# EAGLE design CI_V (EAGLE 7.6.0)
DATABASE: /Users/Kevin/working/CAD_Parts/IHC_Parts_DB.txt

## Sheet 1 of 4: CI-V Arduino Shield
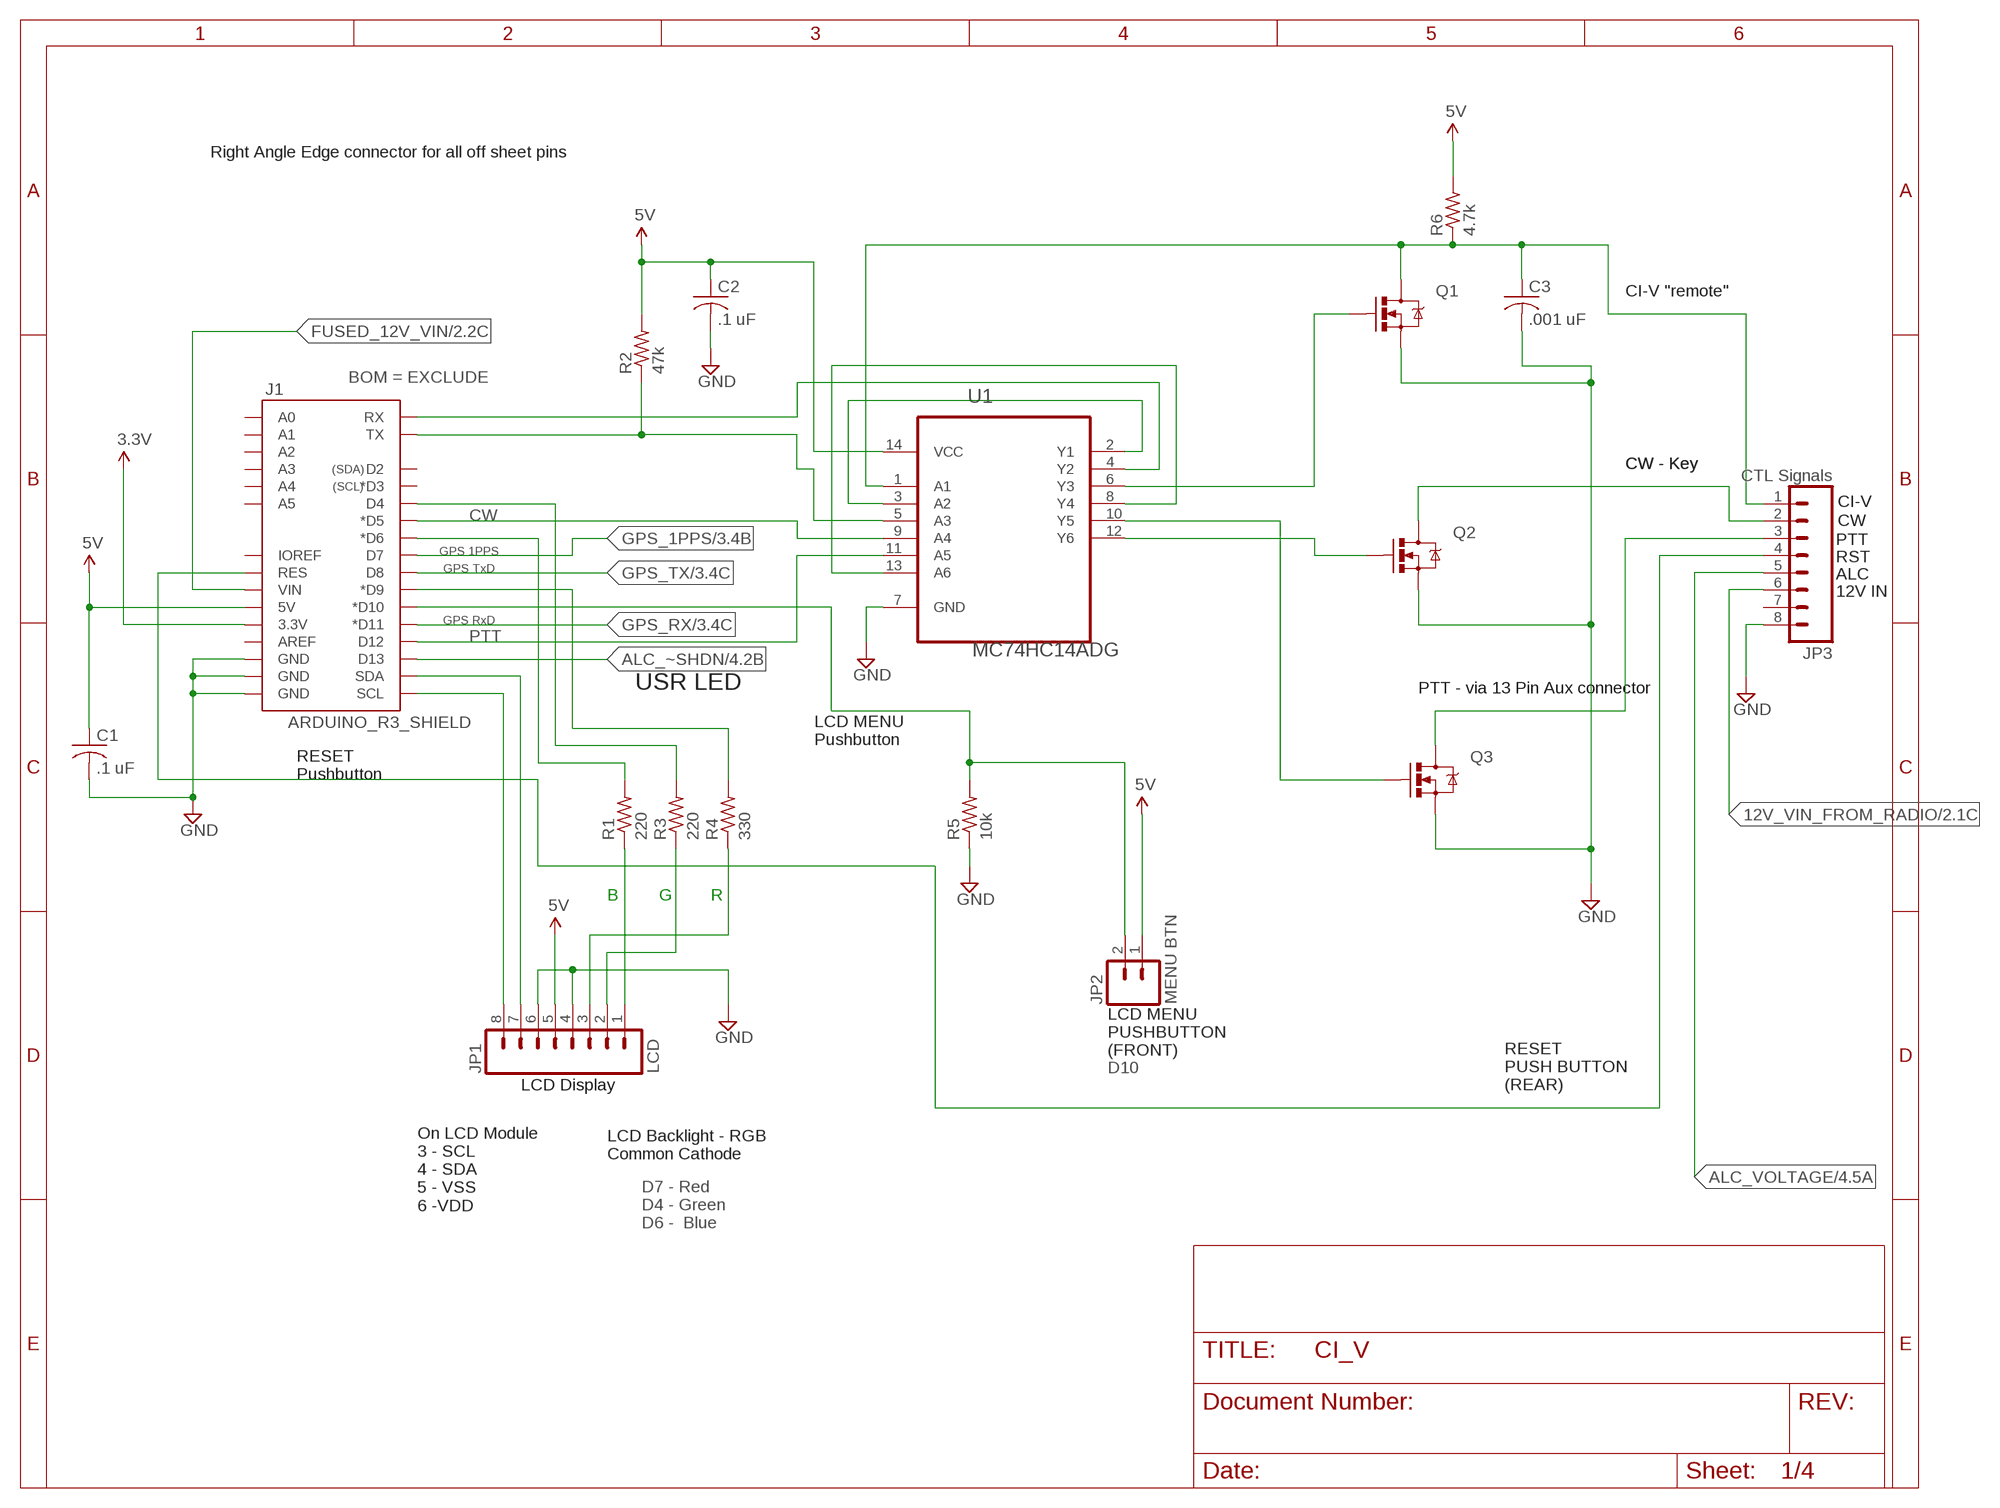
[diagram p0: schematic, sheet 1]

### Parts
C1  .1 uF  C-USC0805  [C0805]
C2  .1 uF  C-USC0805  [C0805]
C3  .001 uF  C-USC0805  [C0805]
J1  ARDUINO_R3_SHIELD  [UNO_R3_SHIELD]
JP1  LCD  M08NO_SILK  [1X08_PIN1_NO_SILK]
JP2  MENU BTN  M02PTH  [1X02]
JP3  CTL Signals  M08NO_SILK  [1X08_PIN1_NO_SILK]
Q1  MOSFET-NCHANNELBSS123LT1G  [SOT23-3]
Q2  MOSFET-NCHANNELBSS123LT1G  [SOT23-3]
Q3  MOSFET-NCHANNELBSS123LT1G  [SOT23-3]
R1  220  R-US_R0805  [R0805]
R2  47k  R-US_R0805  [R0805]
R3  220  R-US_R0805  [R0805]
R4  330  R-US_R0805  [R0805]
R5  10k  R-US_R0805  [R0805]
R6  4.7k  R-US_R0805  [R0805]
U1  MC74HC14ADG  [SOIC127P600X175-14N]

### Nets
3.3V: J1.3.3V ; also sheet 3
5V: C1.1 C2.1 J1.5V JP1.5 JP2.1 R2.2 R6.2 U1.14(VCC) ; also sheet 4
12V_VIN_FROM_RADIO: JP3.6 ; also sheet 2
ALC_VOLTAGE: JP3.5 ; also sheet 4
ALC_~SHDN: J1.D13 ; also sheet 4
CW: J1.D5(*D5) U1.9(A4)
FUSED_12V_VIN: J1.VIN ; also sheet 2
GND: C1.2 C2.2 C3.2 J1.GND@0(GND) J1.GND@1(GND) J1.GND@2(GND) JP1.4 JP1.6 JP3.8 Q1.2(S) Q2.2(S) Q3.2(S) R5.1 U1.7(GND) ; also sheet 2,3,4
GPS_1PPS: J1.D7 ; also sheet 3
GPS_RX: J1.D11(*D11) ; also sheet 3
GPS_TX: J1.D8 ; also sheet 3
HARD_RX: J1.RX U1.4(Y2)
HARD_TX: J1.TX R2.1 U1.5(A3)
N$1: C3.1 JP3.1 Q1.3(D) R6.1 U1.1(A1)
N$2: JP3.2 Q2.3(D)
N$3: JP3.3 Q3.3(D)
N$4: Q1.1(G) U1.6(Y3)
N$5: JP1.1 R1.1
N$7: JP1.2 R3.1
N$8: U1.2(Y1) U1.3(A2)
N$9: Q2.1(G) U1.12(Y6)
N$10: Q3.1(G) U1.10(Y5)
N$12: J1.SCL JP1.8
N$13: U1.8(Y4) U1.13(A6)
N$14: J1.SDA JP1.7
N$15: JP1.3 R4.1
N$16: J1.D6(*D6) R1.2
N$17: J1.D4 R3.2
N$18: J1.D9(*D9) R4.2
N$19: J1.D10(*D10) JP2.2 R5.2
N$20: J1.RES JP3.4
PTT: J1.D12 U1.11(A5)
Unconnected: J1.A0 J1.A1 J1.A2 J1.A3 J1.A4 J1.A5 J1.AREF J1.D2 J1.D3(*D3) J1.IOREF JP3.7

### Notes on the sheet
- Right Angle Edge connector for all off sheet pins
- CI-V "remote"
- CW - Key | CW - Key
- CI-V
- CW
- PTT
- GPS 1PPS
- RST
- GPS TxD
- ALC
- 12V IN
- GPS RxD
- USR LED | PTT - via 13 Pin Aux connector
- LCD MENU
  Pushbutton
- RESET
  Pushbutton
- B | G | R
- LCD MENU
  PUSHBUTTON
  (FRONT)
- D10
- LCD Display
- RESET
  PUSH BUTTON
  (REAR)
- LCD Backlight - RGB
  Common Cathode
- On LCD Module
  3 - SCL
  4 - SDA
  5 - VSS
  6 -VDD
- D7 - Red
  D4 - Green
  D6 -  Blue

## Sheet 2 of 4: Power
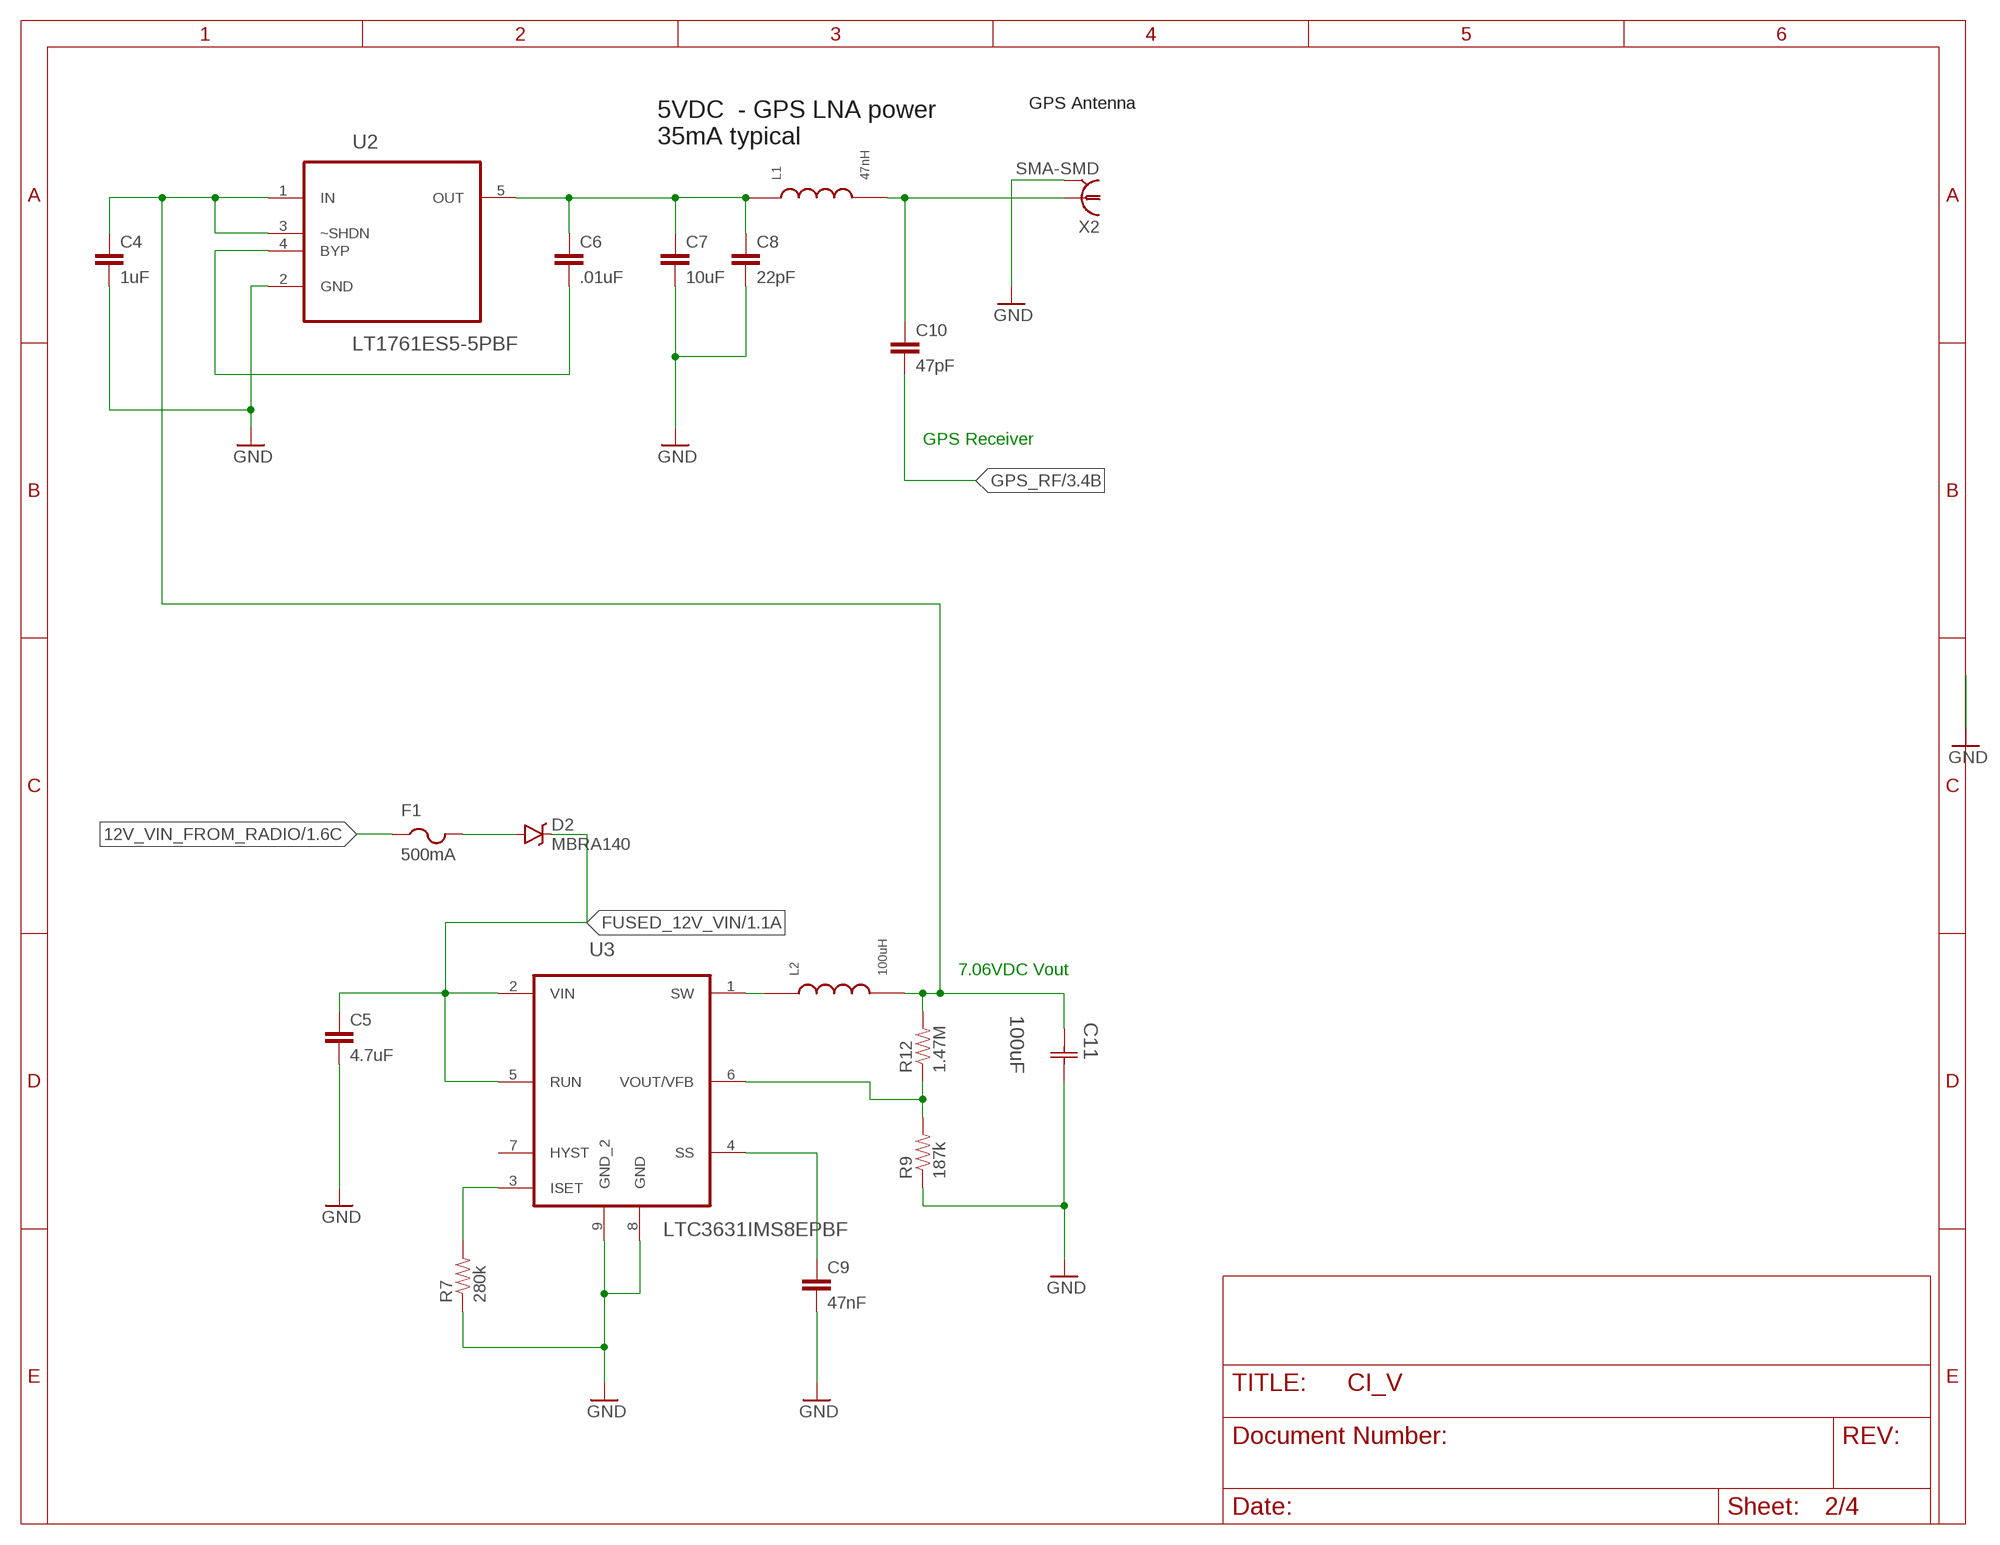
[diagram p1: schematic, sheet 2]

### Parts
C4  1uF  CAP0805  [0805]
C5  4.7uF  CAP1210  [1210]
C6  .01uF  CAP0805  [0805]
C7  10uF  CAP1210  [1210]
C8  22pF  CAP0805  [0805]
C9  47nF  CAP0805  [0805]
C10  47pF  CAP0805  [0805]
C11  100uF  THJC226K016RJN  [CAPCP6032X280N]
D2  MBRA140  DIODE-SCHOTTKY-MBRA140  [SMA-DIODE]
F1  500mA  PTCFUSE-1206  [R1206]
L1  47nH  INDUCTORMURATA  [0805]
L2  100uH  INDUCTORMURATATDK  [SLF7045]
R7  280k  RESISTOR0805-RES  [0805]
R9  187k  RESISTOR0805-RES  [0805]
R12  1.47M  RESISTOR0805-RES  [0805]
U2  LT1761ES5-5PBF  [SOT95P280X100-5N]
U3  LTC3631IMS8EPBF  [SOP65P490X110-9N]
X2  SMA-SMD  [SMA-SMD]

### Nets
7V_BUS: C4.1 C11.1(C1) L2.2 R12.2 U2.1(IN) U2.3(~SHDN)
12V_VIN_FROM_RADIO: F1.1 ; also sheet 1
FUSED_12V_VIN: C5.1 D2.C U3.2(VIN) U3.5(RUN) ; also sheet 1
GND: C4.2 C5.2 C7.2 C8.2 C9.2 C11.2(C2) R7.1 R9.1 U2.2(GND) U3.8(GND) U3.9(GND_2) X2.2@1 X2.2@2 X2.2@3 X2.2@4 X2.2@5 X2.2@6 ; also sheet 1,3,4
GPS_RF: C10.2 ; also sheet 3
ISET: R7.2 U3.3(ISET)
N$6: C10.1 L1.2 X2.1
N$21: C6.2 U2.4(BYP)
N$25: D2.A F1.2
SS: C9.1 U3.4(SS)
SW: L2.1 U3.1(SW)
VCC: C6.1 C7.1 C8.1 L1.1 U2.5(OUT)
VFB: R9.2 R12.1 U3.6(VOUT/VFB)
Unconnected: U3.7(HYST)

### Notes on the sheet
- GPS Antenna
- 5VDC  - GPS LNA power
  35mA typical
- GPS Receiver
- 7.06VDC Vout

## Sheet 3 of 4: GPS Receiver
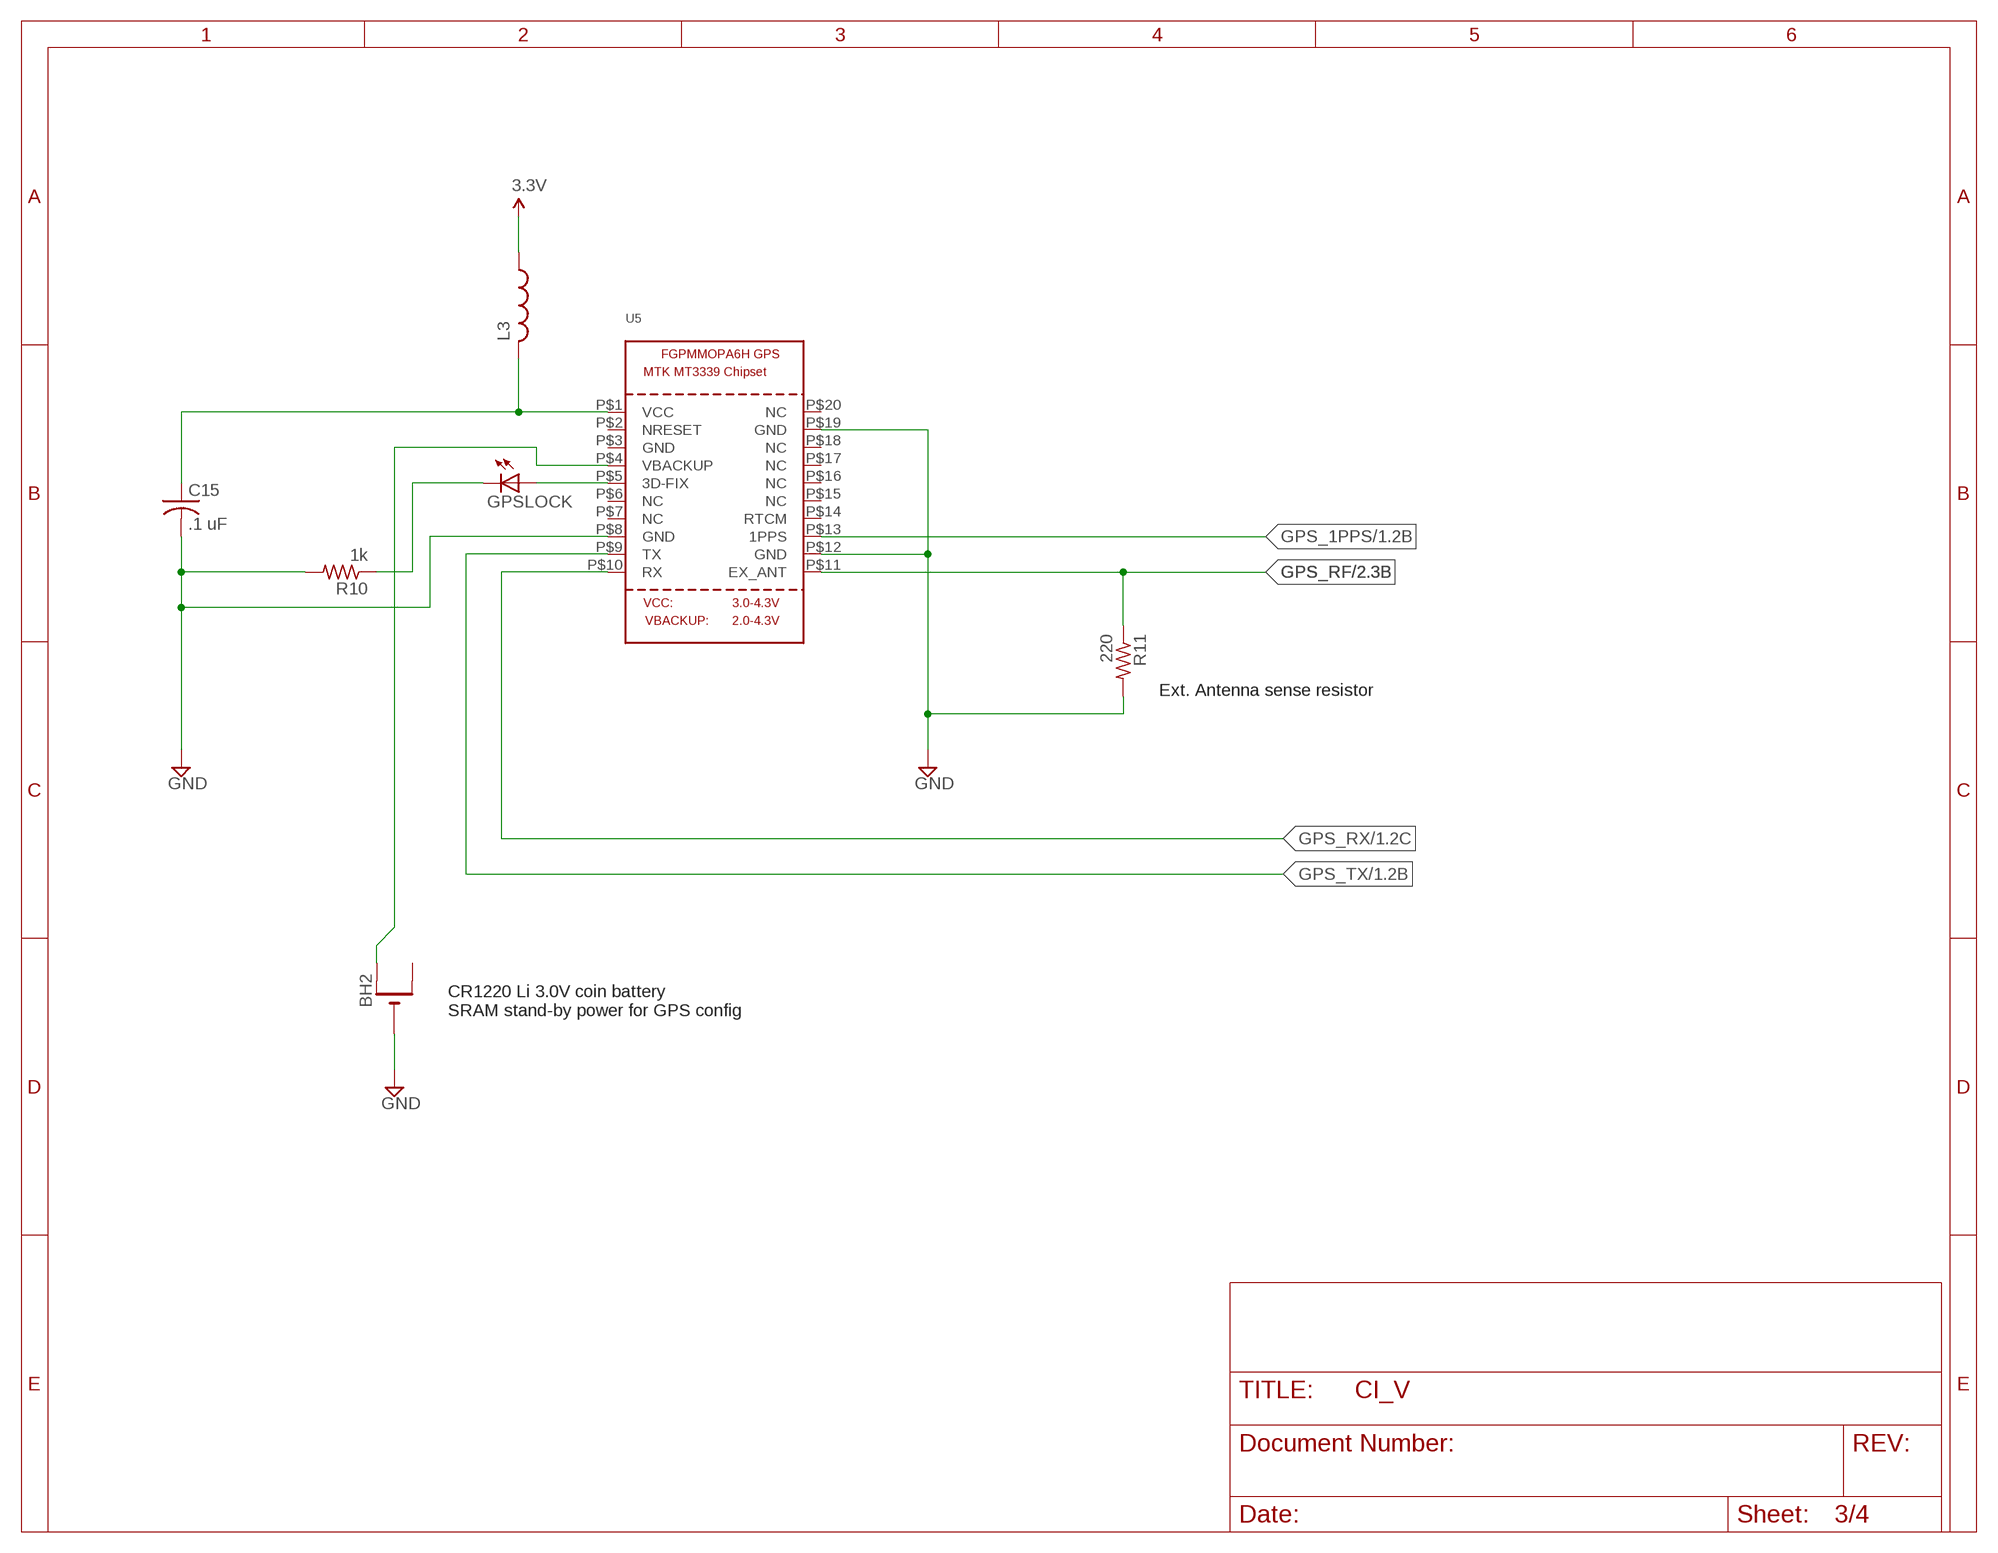
[diagram p2: schematic, sheet 3]

### Parts
BH2  CR1220SMT  [CR1220-SMD]
C15  .1 uF  C-USC0805  [C0805]
GPSLOCK  LEDCHIPLED_0805  [CHIPLED_0805]
L3  L-USL2012C  [L2012C]
R10  1k  R-US_R0805  [R0805]
R11  220  R-US_R0805  [R0805]
U5  GPS_FGPMMOPA6H  [FGPMMOPA6H]

### Nets
3.3V: L3.1 ; also sheet 1
GND: BH2.- C15.2 R10.2 R11.2 U5.P$8(GND) U5.P$12(GND) U5.P$19(GND) ; also sheet 1,2,4
GPS_1PPS: U5.P$13(1PPS) ; also sheet 1
GPS_BATT: BH2.+$1(+) U5.P$4(VBACKUP)
GPS_RF: R11.1 U5.P$11(EX_ANT) ; also sheet 2
GPS_RX: U5.P$10(RX) ; also sheet 1
GPS_TX: U5.P$9(TX) ; also sheet 1
N$11: C15.1 L3.2 U5.P$1(VCC)
N$22: GPSLOCK.A U5.P$5(3D-FIX)
N$23: GPSLOCK.C R10.1
Unconnected: BH2.+$2(+1) U5.P$2(NRESET) U5.P$3(GND) U5.P$6(NC) U5.P$7(NC) U5.P$14(RTCM) U5.P$15(NC) U5.P$16(NC) U5.P$17(NC) U5.P$18(NC) U5.P$20(NC)

### Notes on the sheet
- Ext. Antenna sense resistor
- CR1220 Li 3.0V coin battery
  SRAM stand-by power for GPS config

## Sheet 4 of 4: ALC control
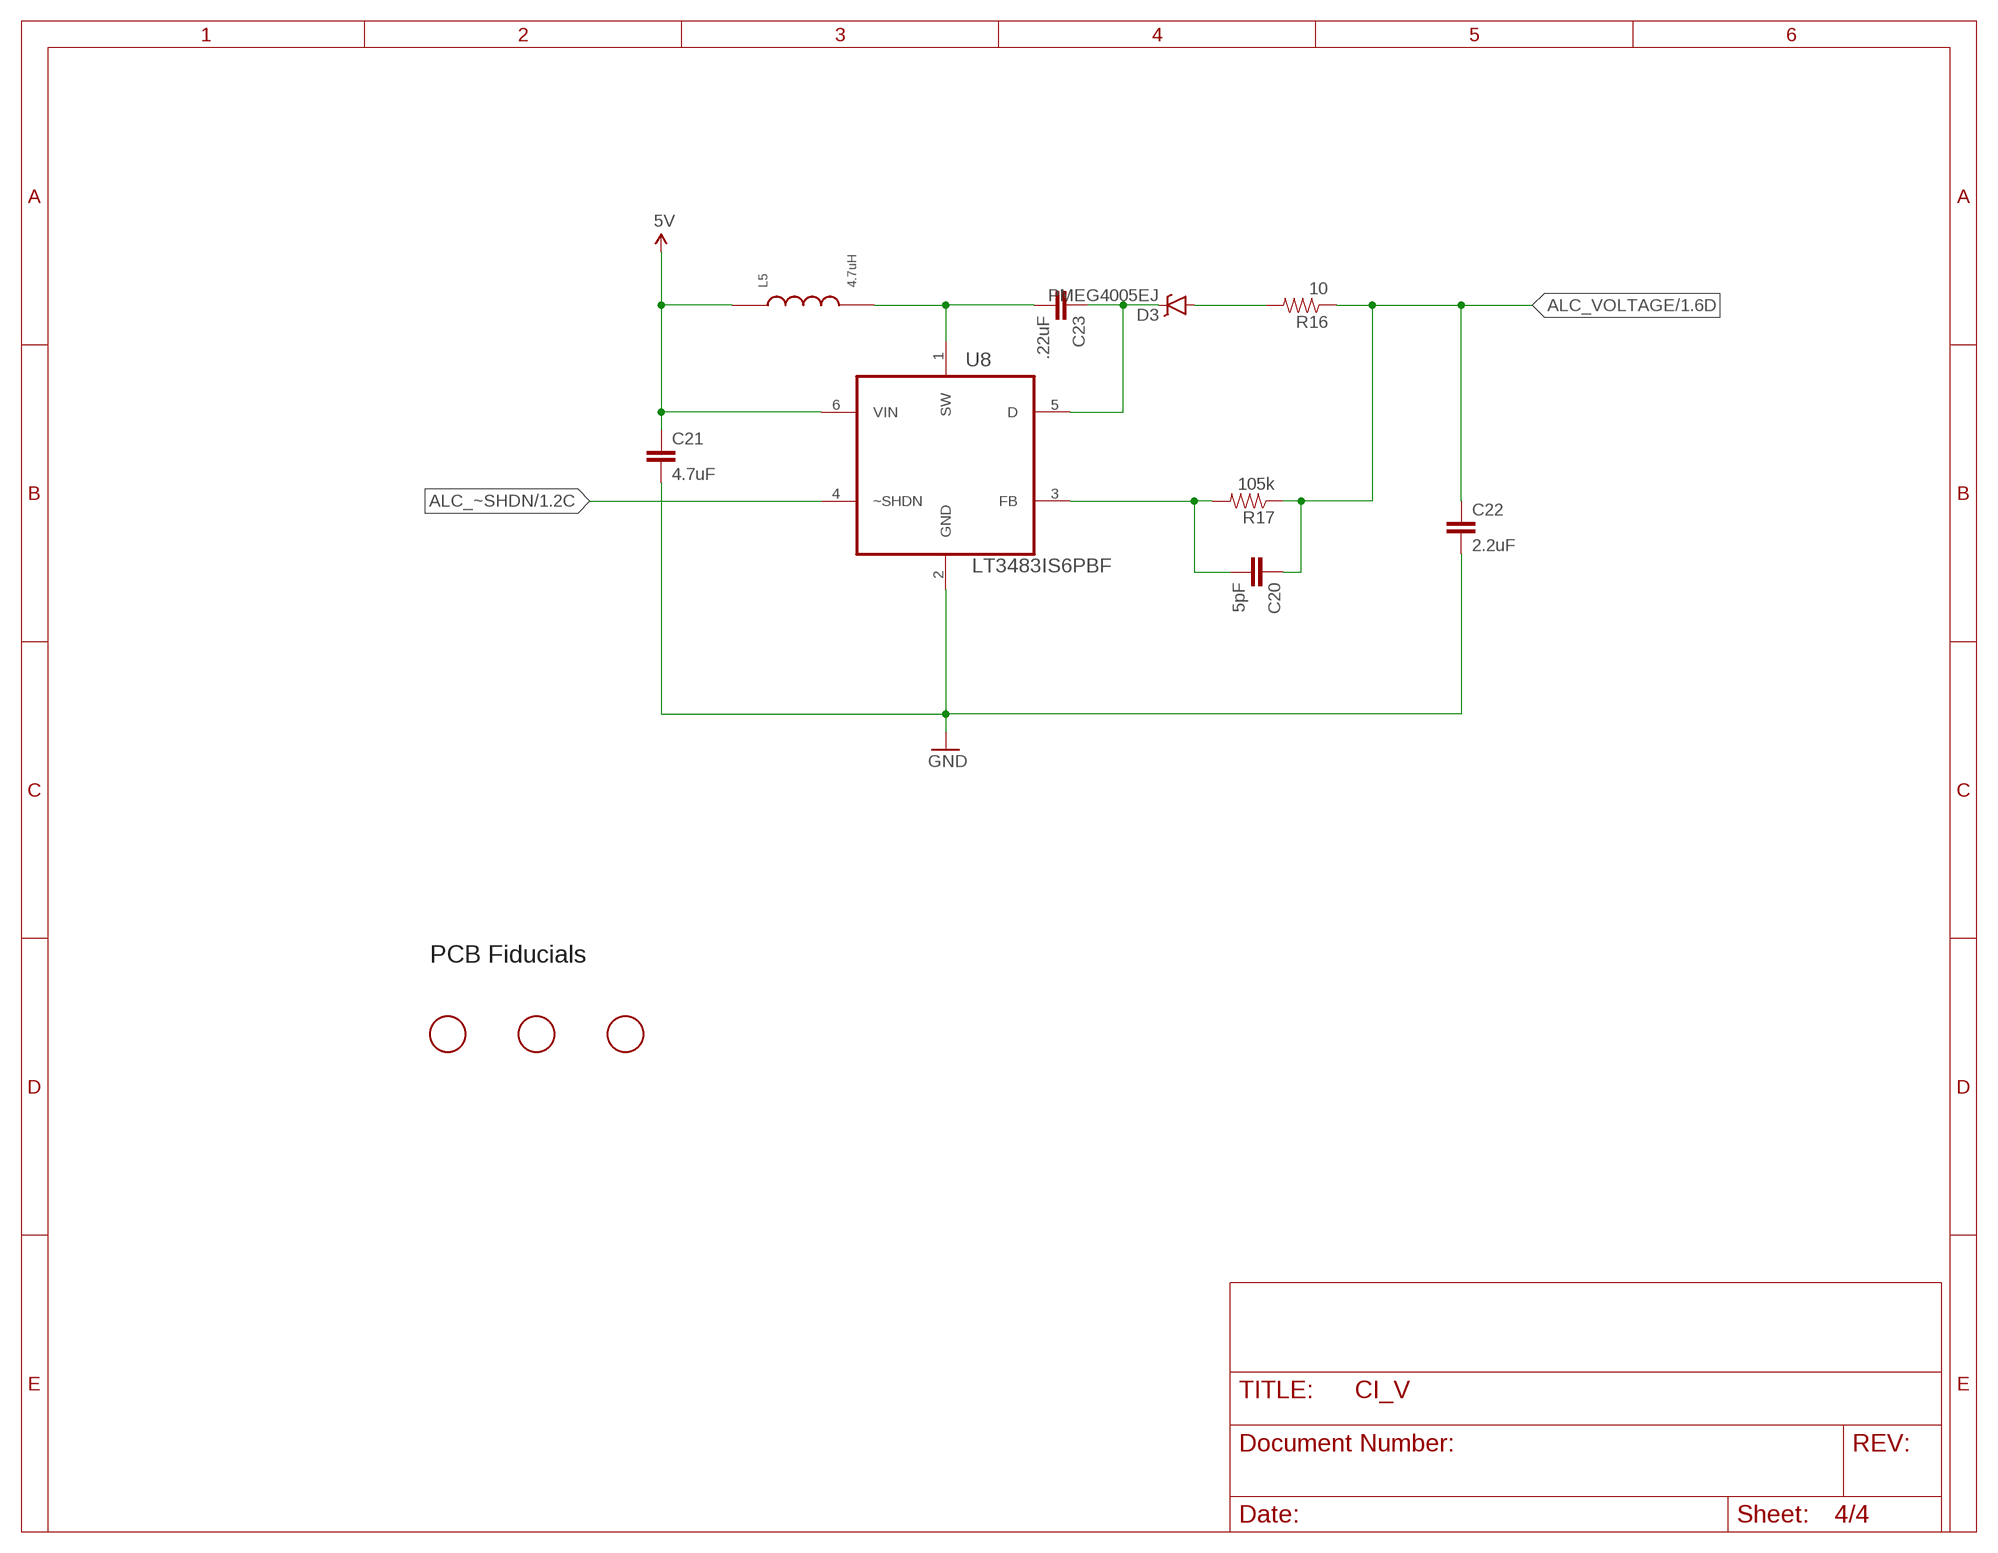
[diagram p3: schematic, sheet 4]

### Parts
C20  5pF  CAP0805  [0805]
C21  4.7uF  CAP1210  [1210]
C22  2.2uF  CAP0805  [0805]
C23  .22uF  CAP0805  [0805]
D3  PMEG4005EJ  DIODE-SCHOTTKY-PMEG4005EJ  [SOD-323]
L5  4.7uH  INDUCTORMURATA  [0805]
R16  10  RESISTOR0805-RES  [0805]
R17  105k  RESISTOR0805-RES  [0805]
U8  LT3483IS6PBF  [SOT95P280X100-6N]
U$1  FIDUCIAL  [FIDUCIAL_1MM]
U$6  FIDUCIAL  [FIDUCIAL_1MM]
U$7  FIDUCIAL  [FIDUCIAL_1MM]

### Nets
5V: C21.1 L5.1 U8.6(VIN) ; also sheet 1
ALC_VOLTAGE: C20.1 C22.1 R16.1 R17.1 ; also sheet 1
ALC_~SHDN: U8.4(~SHDN) ; also sheet 1
GND: C21.2 C22.2 U8.2(GND) ; also sheet 1,2,3
N$27: D3.A R16.2
N$28: C23.2 L5.2 U8.1(SW)
N$33: C23.1 D3.C U8.5(D)
N$37: C20.2 R17.2 U8.3(FB)

### Notes on the sheet
- PCB Fiducials

## Library data of the parts
BH2 = IHC:CR1220: CR1216/CR1220/CR1225 12mm 3V lithium coin cell Great for battery packup. Both SMT and THM holders. Note the THM package has the ground pads on both sides of the PCB so that the masks are the same - this reduces the cost; PARTNO: 165-0001-001
C1 C2 C15 = rcl:C-US: CAPACITOR, American symbol; PARTNO: 120-0001-010
C3 = rcl:C-US: CAPACITOR, American symbol; PARTNO: 120-0001-015
C4 = SparkFun-Capacitors:CAP: Capacitor Standard 0603 ceramic capacitor, and 0.1" leaded capacitor.; PARTNO: 120-0001-015
C5 C21 = SparkFun-Capacitors:CAP: Capacitor Standard 0603 ceramic capacitor, and 0.1" leaded capacitor.; PARTNO: 120-0003-011
C6 = SparkFun-Capacitors:CAP: Capacitor Standard 0603 ceramic capacitor, and 0.1" leaded capacitor.; PARTNO: 120-0001-020
C7 = SparkFun-Capacitors:CAP: Capacitor Standard 0603 ceramic capacitor, and 0.1" leaded capacitor.; PARTNO: 120-0003-010
C8 = SparkFun-Capacitors:CAP: Capacitor Standard 0603 ceramic capacitor, and 0.1" leaded capacitor.; PARTNO: 120-0004-011
C9 = SparkFun-Capacitors:CAP: Capacitor Standard 0603 ceramic capacitor, and 0.1" leaded capacitor.; PARTNO: 120-0001-013
C10 C20 = SparkFun-Capacitors:CAP: Capacitor Standard 0603 ceramic capacitor, and 0.1" leaded capacitor.; PARTNO: 120-0004-010
C11 = AVX_By_element14_Batch_1:THJC226K016RJN: Tantalum Capacitor , 2312; CAPACITANCETOLERANCE: ±10%; MPN: THJC226K016RJN; OC_FARNELL: 1707045; OC_NEWARK: 57P7383; PARTNO: 120-0005-050; SUPPLIER: AVX; VALUE: 22µF; VOLTAGERATING: 16V
C22 = SparkFun-Capacitors:CAP: Capacitor Standard 0603 ceramic capacitor, and 0.1" leaded capacitor.; PARTNO: 120-0002-011
C23 = SparkFun-Capacitors:CAP: Capacitor Standard 0603 ceramic capacitor, and 0.1" leaded capacitor.; PARTNO: 120-0001-022
D2 = SparkFun-DiscreteSemi:DIODE-SCHOTTKY: Schottky diodes in SFE's production catalog BAT20J 1A 23V 0.62Vf RB751 120mA 40V 0.37Vf PMEG4005EJ 0.5A 40V 0.42Vf MBRA140 1A 40V 0.5Vf B340A 3A 40V SMA; PARTNO: 140-0001-001; PROD_ID: DIO-08053
D3 = SparkFun-DiscreteSemi:DIODE-SCHOTTKY: Schottky diodes in SFE's production catalog BAT20J 1A 23V 0.62Vf RB751 120mA 40V 0.37Vf PMEG4005EJ 0.5A 40V 0.42Vf MBRA140 1A 40V 0.5Vf B340A 3A 40V SMA; PARTNO: 140-0002-001; PROD_ID: DIO-10955
F1 = adafruit:PTCFUSE: PTC fuses, resettable thermistors; PARTNO: 145-0001-001
GPSLOCK = adafruit:LED: LED OSRAM: - CHIPLED LG R971, LG N971, LY N971, LG Q971, LY Q971, LO R971, LY R971 LH N974, LH R974 LS Q976, LO Q976, LY Q976 LO Q996 - Hyper CHIPLED LW Q18S LB Q993, LB Q99A, LB R99A - SideLED LS A670, LO A670, LY A670, LG A670, LP A670 LB A673, LV A673, LT A673, LW A673 LH A674 LY A675 LS A676, LA A676, LO A676, LY A676, LW A676 LS A679, LY A679, LG A679 - Hyper Micro SIDELED® LS Y876, LA Y876, LO Y876, LY Y876 LT Y87S - SmartLED LW L88C, LW L88S LB L89C, LB L89S, LG L890 LS L89K, LO L89K, LY L89K LS L896, LA L896, LO L896, LY L896 - TOPLED LS T670, LO T670, LY T670, LG T670, LP T670 LSG T670, LSP T670, LSY T670, LOP T670, LYG T670 LG T671, LOG T671, LSG T671 LB T673, LV T673, LT T673, LW T673 LH T674 LS T676, LA T676, LO T676, LY T676, LB T676, LH T676, LSB T676, LW T676 LB T67C, LV T67C, LT T67C, LS T67K, LO T67K, LY T67K, LW E67C LS E67B, LA E67B, LO E67B, LY E67B, LB E67C, LV E67C, LT E67C LW T67C LS T679, LY T679, LG T679 LS T770, LO T770, LY T770, LG T770, LP T770 LB T773, LV T773, LT T773, LW T773 LH T774 LS E675, LA E675, LY E675, LS T675 LS T776, LA T776, LO T776, LY T776, LB T776 LHGB T686 LT T68C, LB T68C - Hyper Mini TOPLED® LB M676 - Mini TOPLED Santana® LG M470 LS M47K, LO M47K, LY M47K Source: http://www.osram.convergy.de/; PARTNO: 160-0007-001
J1 = IHC:ARDUINO_R3_SHIELD: Shield form compatible with the Arduino Uno R3.; BOM: EXCLUDE
JP1 JP3 = SparkFun-Connectors:M08: Header 8 Standard 8-pin 0.1" header. Use with straight break away headers (SKU : PRT-00116), right angle break away headers (PRT-00553), swiss pins (PRT-00743), machine pins (PRT-00117), and female headers (PRT-00115).; PARTNO: 125-0019-001
JP2 = IHC:M02: Standard 2-pin 0.1" header. Use with - straight break away headers ( PRT-00116) - right angle break away headers (PRT-00553) - swiss pins (PRT-00743) - machine pins (PRT-00117) - female headers (PRT-00115) Molex polarized connector foot print use with: PRT-08233 with associated crimp pins and housings. 2.54_SCREWTERM for use with PRT-10571. 3.5mm Screw Terminal footprints for PRT-08084 5mm Screw Terminal footprints for use with PRT-08432; PARTNO: 125-0019-001
L1 = IHC:INDUCTOR; PARTNO: 155-0002-001
L2 = IHC:INDUCTOR; PARTNO: 155-0001-001
L3 = rcl:L-US: INDUCTOR, American symbol; PARTNO: 155-0004-001
L5 = IHC:INDUCTOR; PARTNO: 155-0003-001
Q1-Q3 = SparkFun-DiscreteSemi:MOSFET-NCHANNEL: Common NMOSFET Parts MFG P/N Store ID Prod ID FDD8780 TRANS-09984 SI7820DN TRANS-11055 FDS6630A IC-08089 2N7002PW TRANS-11151 FQP30N06L COM-10213 TRANS-10060 BSS123LT1G TRANS-08345 BSS138 TRANS-00830 BS170 2N7000; PARTNO: 185-0001-001; PROD_ID: TRANS-08345
R1 R3 R11 = rcl:R-US_: RESISTOR, American symbol; PARTNO: 110-0001-010
R2 R6 = rcl:R-US_: RESISTOR, American symbol; PARTNO: 110-0001-030
R4 R5 = rcl:R-US_: RESISTOR, American symbol; PARTNO: 110-0001-025
R7 = SparkFun-Passives:RESISTOR: Resistor Basic schematic elements and footprints for 0603, 1206, and PTH resistors.; PARTNO: 110-0002-015
R9 = SparkFun-Passives:RESISTOR: Resistor Basic schematic elements and footprints for 0603, 1206, and PTH resistors.; PARTNO: 110-0002-020
R10 = rcl:R-US_: RESISTOR, American symbol; PARTNO: 110-0001-029
R12 = SparkFun-Passives:RESISTOR: Resistor Basic schematic elements and footprints for 0603, 1206, and PTH resistors.; PARTNO: 110-0002-010
R16 = SparkFun-Passives:RESISTOR: Resistor Basic schematic elements and footprints for 0603, 1206, and PTH resistors.; PARTNO: 110-0001-027
R17 = SparkFun-Passives:RESISTOR: Resistor Basic schematic elements and footprints for 0603, 1206, and PTH resistors.; PARTNO: 110-0003-010
U1 = ON Semiconductor_By_element14_Batch_1:MC74HC14ADG: Hex Schmitt-Trigger Inverter; MPN: MC74HC14ADG; OC_FARNELL: 9666931; OC_NEWARK: 71J5595; PACKAGE: SOIC-14; PARTNO: 200-0001-001; SUPPLIER: ON SEMICONDUCTOR
U2 = LTC_By_element14_Batch_1:LT1761ES5-5PBF: 100mA, Low Noise,LDO Micropower Regulators; MPN: LT1761ES5-5#PBF; OC_FARNELL: 1533302; OC_NEWARK: 61M3359; PACKAGE: TSOT-23-5; PARTNO: 230-0002-001; SUPPLIER: Linear Technology
U3 = IHC:LTC3631IMS8EPBF: Step-Down Converter; MPN: LTC3631IMS8E#PBF; OC_FARNELL: -; OC_NEWARK: 24R8687; PACKAGE: MSOP-8; PARTNO: 230-0003-001; SUPPLIER: Linear Technology
U5 = adafruit:GPS_FGPMMOPA6H: GPS Module - MTK MT3339 Chipset, -165dBm sensitivity, 22 channels, 10Hz, auto-select external antenna options; PARTNO: 240-0001-001
U8 = IHC:LT3483IS6PBF: Inverting Micropower DC/DC Converters with Schottky; MPN: LT3483IS6#PBF; OC_FARNELL: -; OC_NEWARK: 84R9683; PACKAGE: TSOT-23-6; SUPPLIER: Linear Technology
U$1 U$6 U$7 = adafruit:FIDUCIAL: For use by pick and place machines to calibrate the vision/machine, 1mm By microbuilder.eu
X2 = con-coax:SMA-SMD: SMA 50 Ohm Straight Jack Receptacle - Surface Mount www.johnsoncomponents.com Source: http://catalog.digikey.com .. 142-0711-201, 205, 202, 206.pdf; OC_FARNELL: unknown; OC_NEWARK: unknown; PARTNO: 125-0018-001

## Net classes
0 default: clearance 0.205 mm

## Board
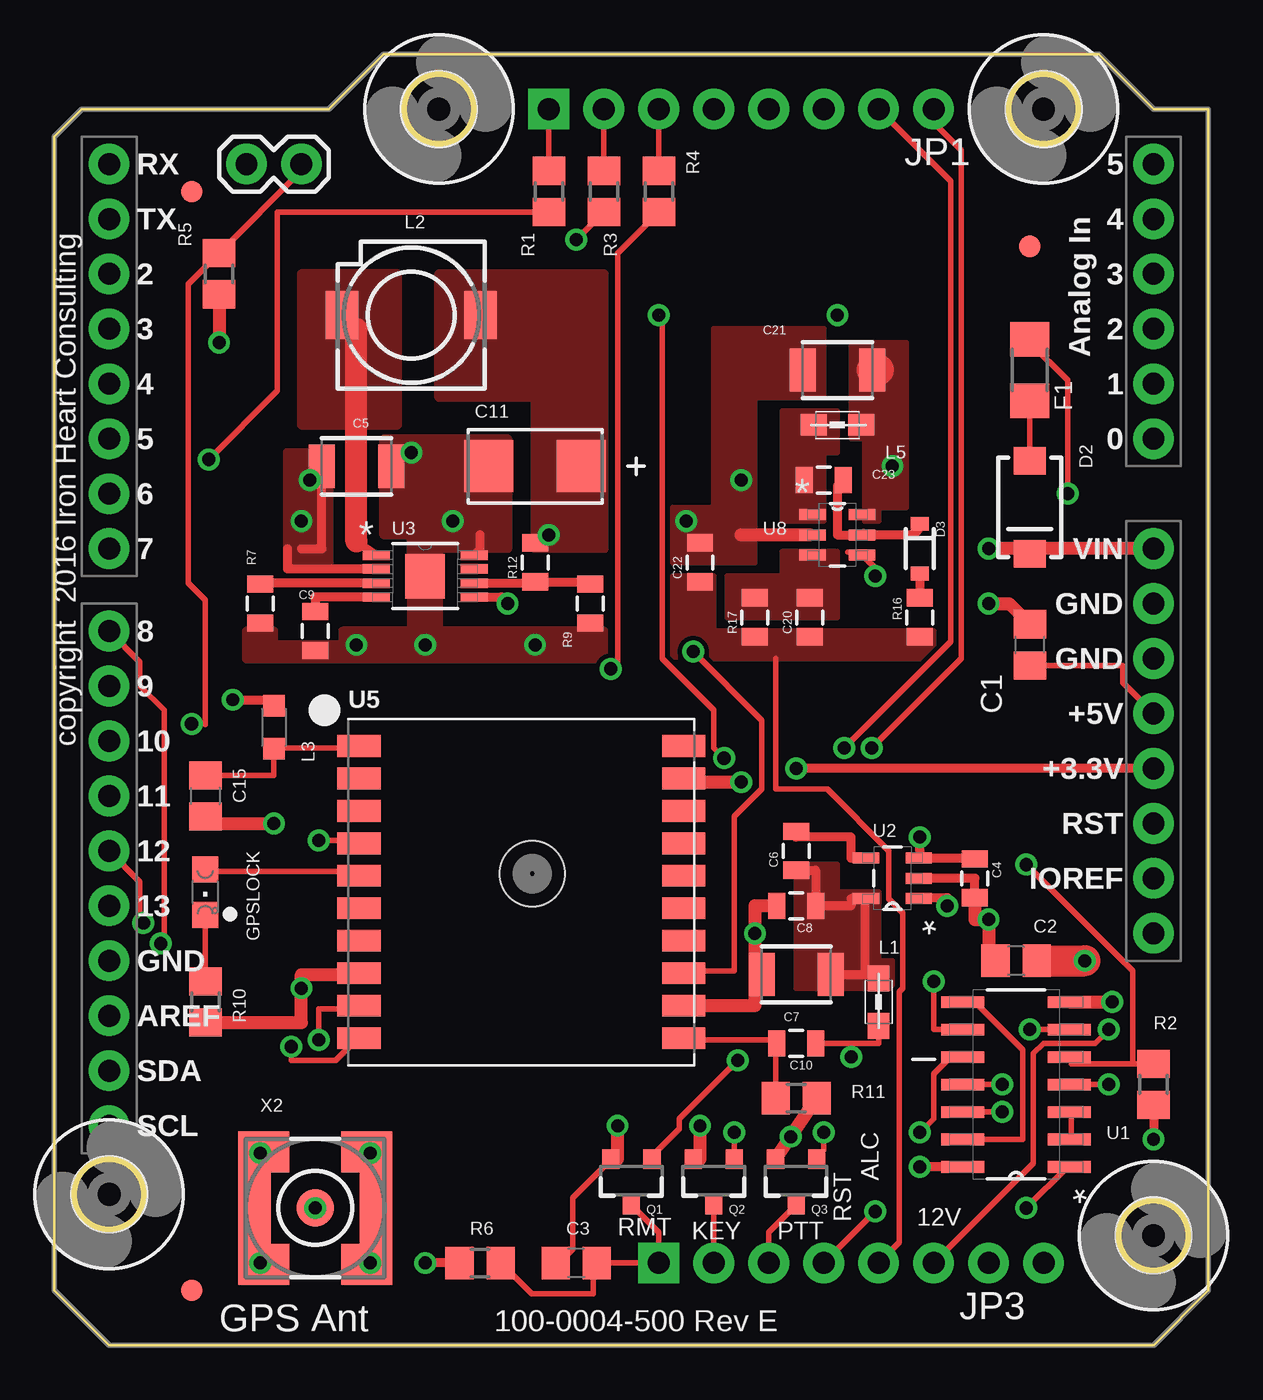
[diagram p4: board, top side]
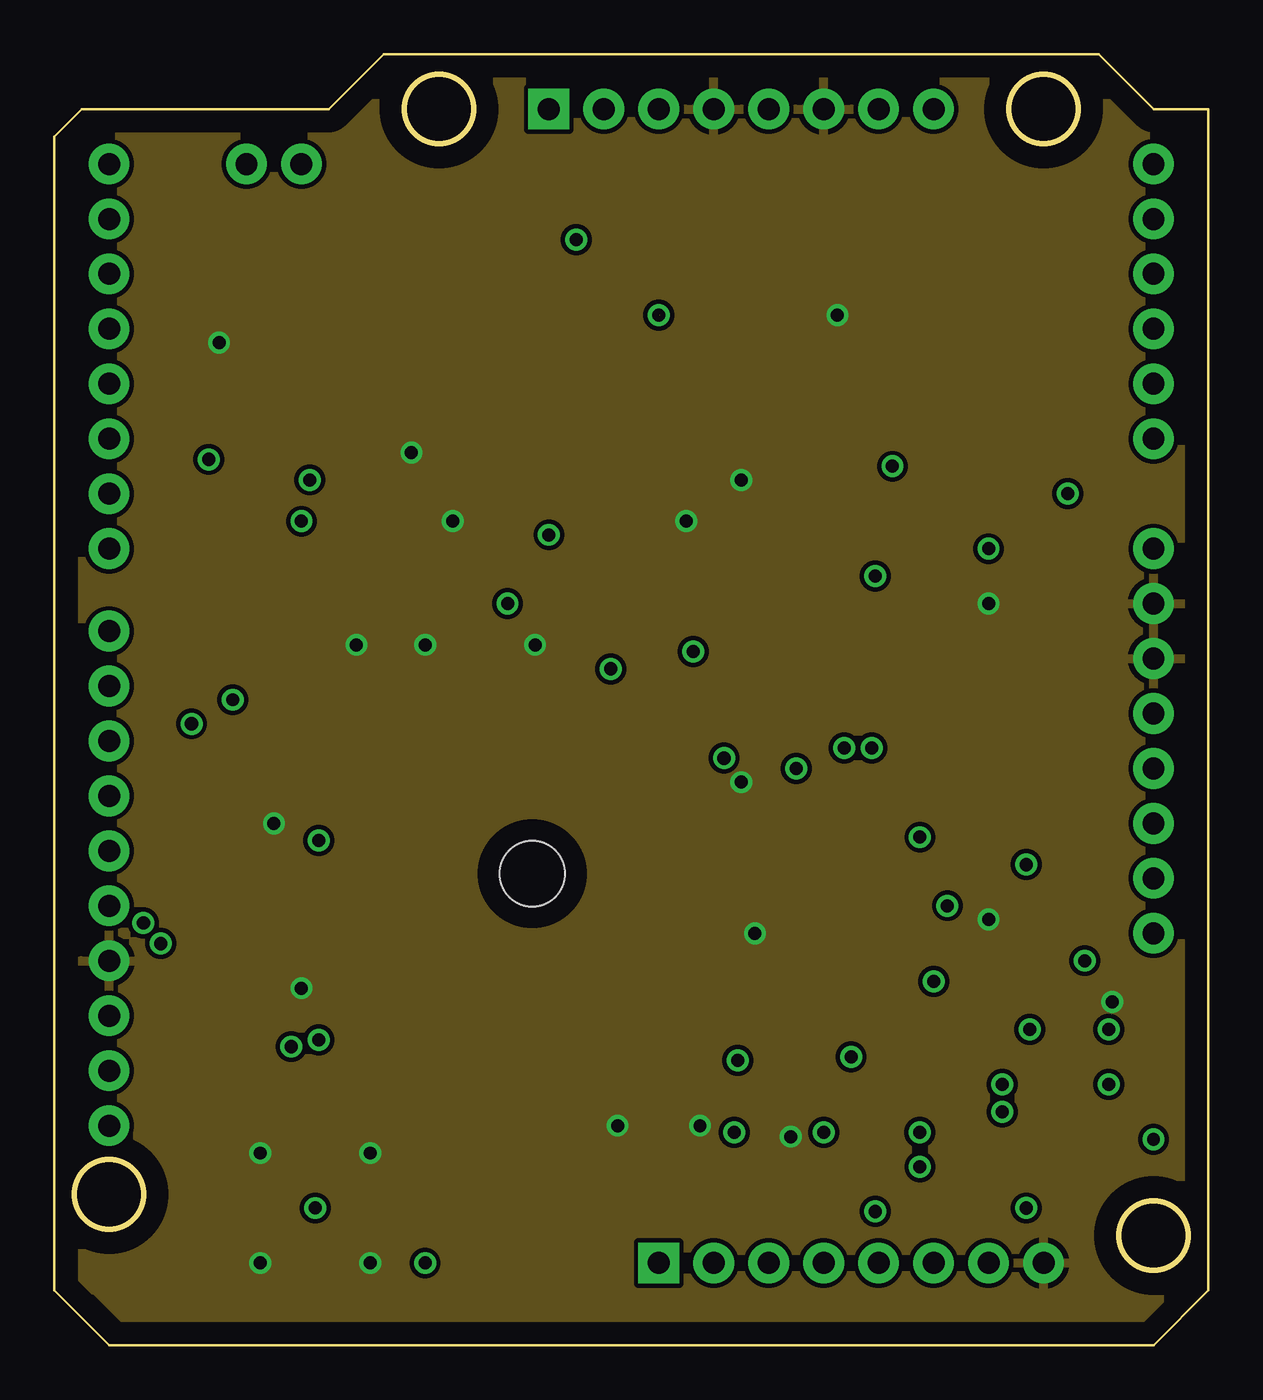
[diagram p5: board, inner layer Route2]
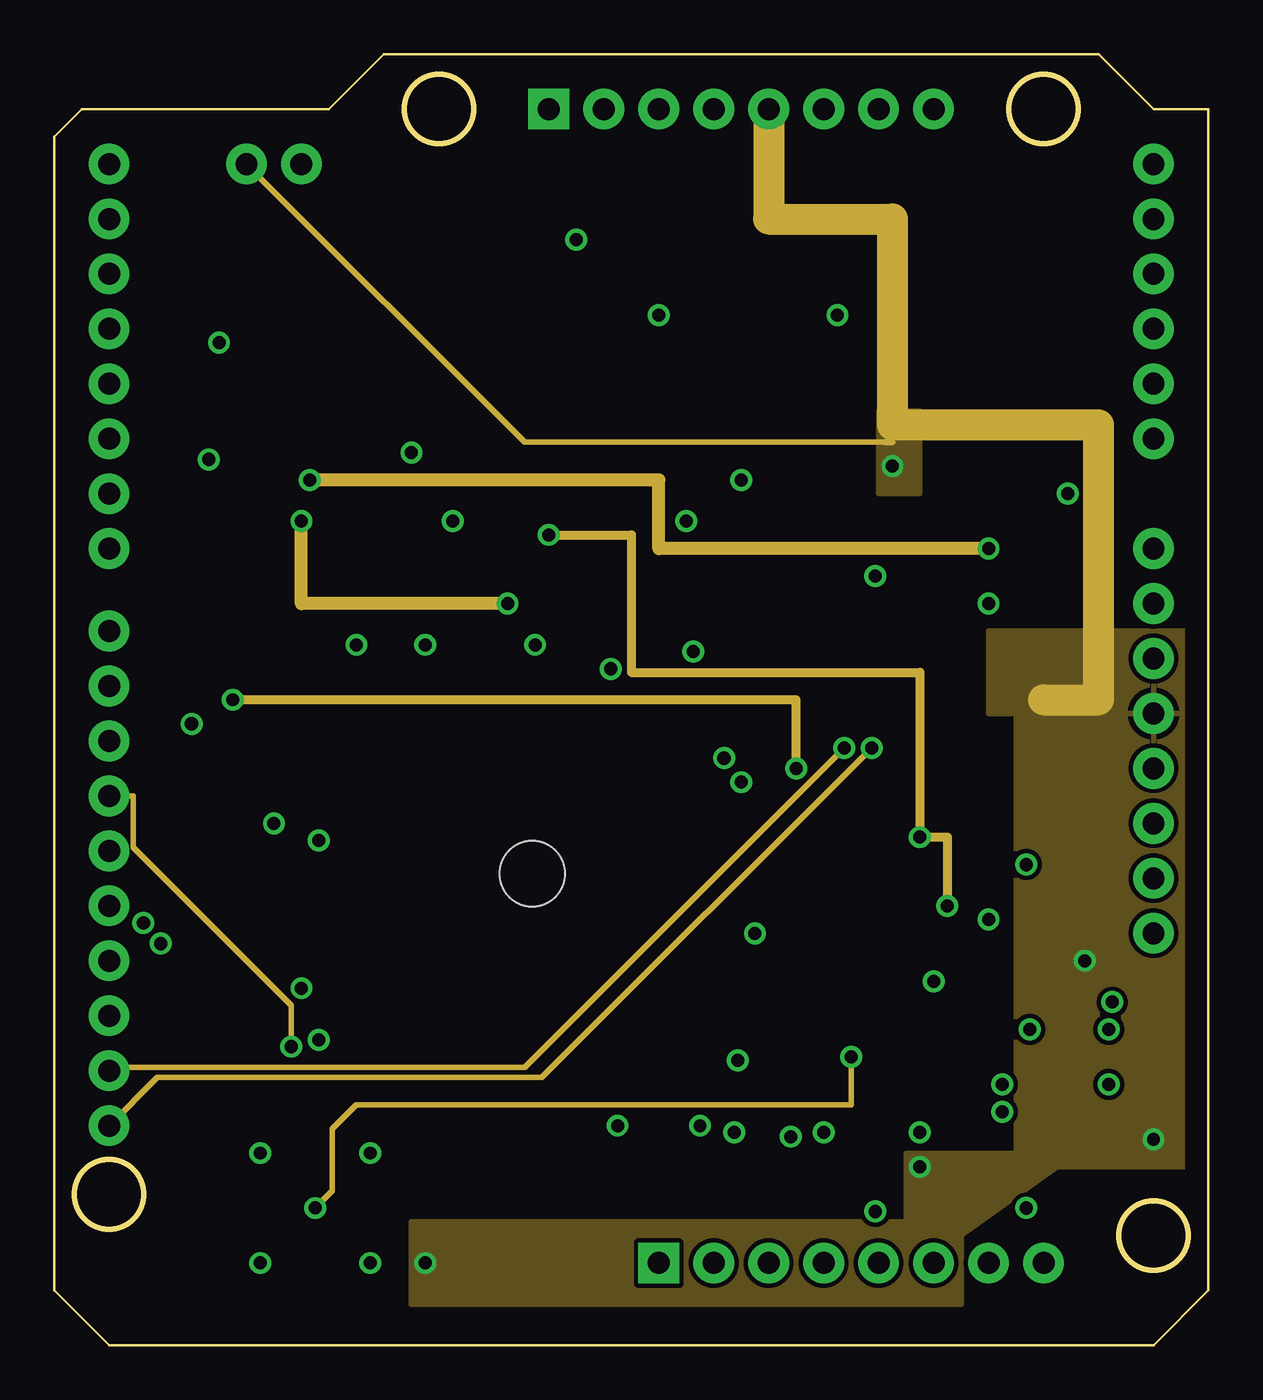
[diagram p6: board, inner layer Route15]
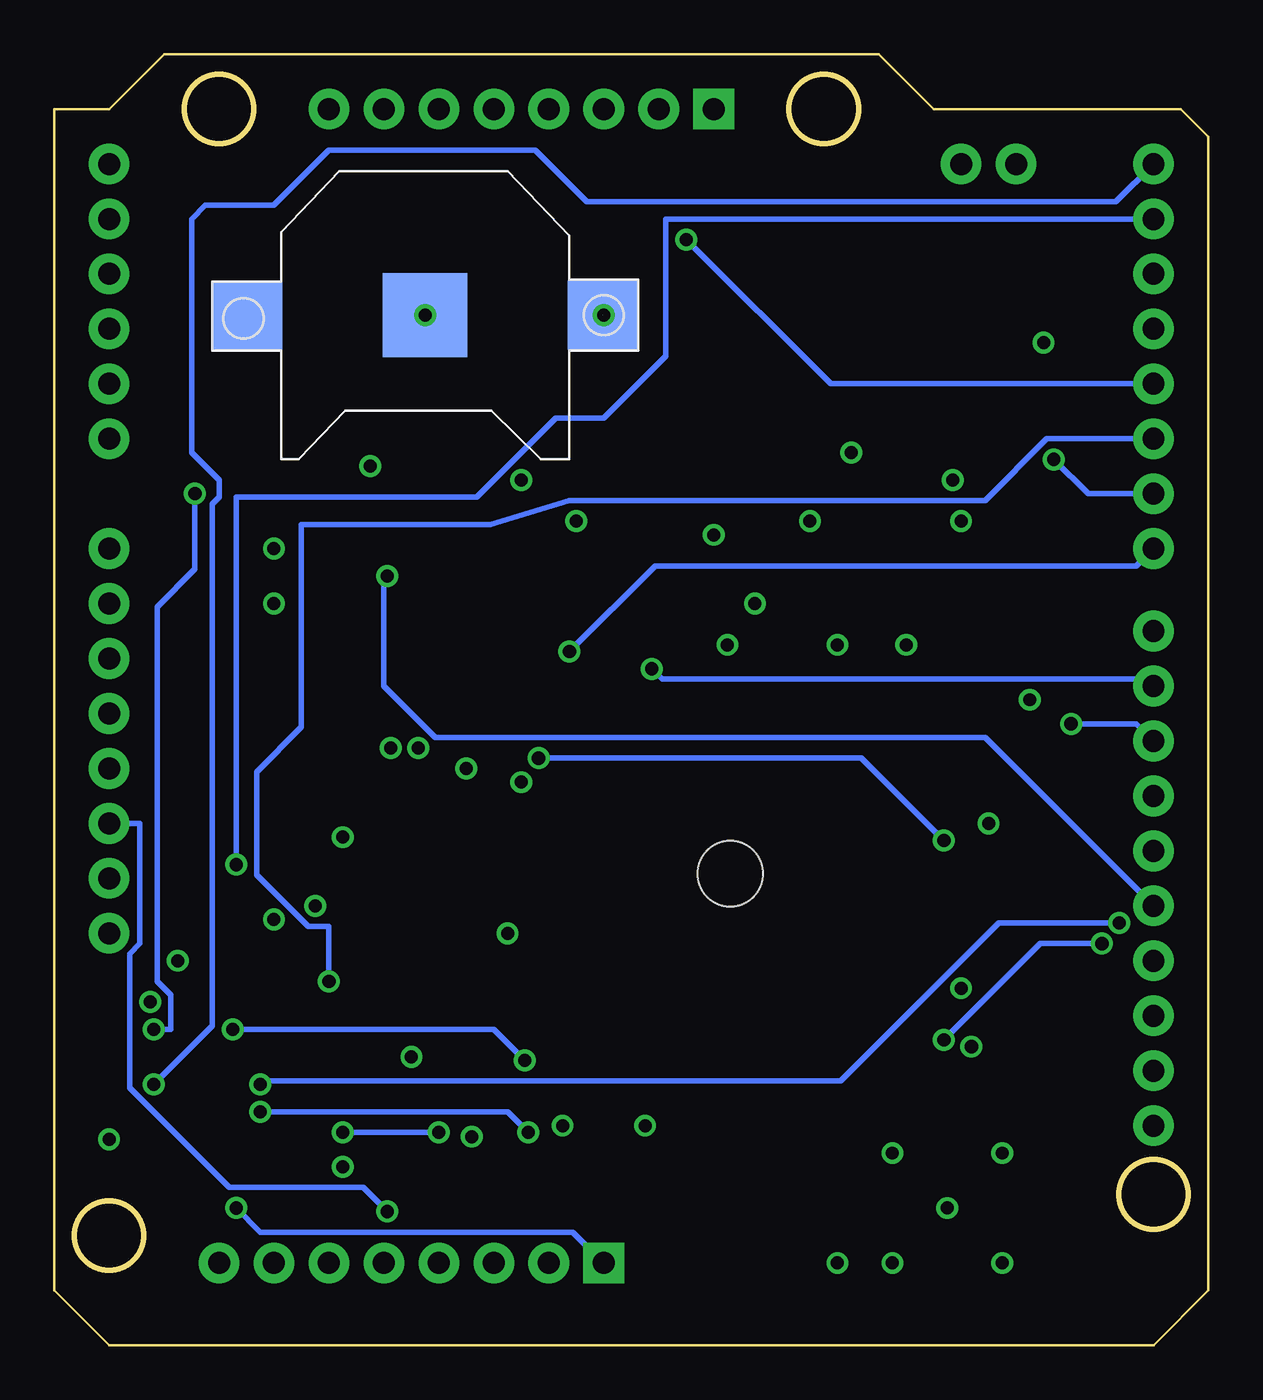
[diagram p7: board, bottom side, seen from below]

Size 51.46 x 55.27 mm. Coordinates in mm from the lower left corner, seen from the top.
Outline: circle at 44.78,53.67 radius 1.6
Outline: circle at 1.6,3.51 radius 1.6
Outline: circle at 49.86,1.6 radius 1.6
Outline: circle at 16.84,53.67 radius 1.6
Copper layers (1*2+15*16): Top 0.035mm / dielectric 0.2mm / Route2 0.035mm / dielectric 1.5mm / Route15 0.035mm / dielectric 0.2mm / Bottom 0.035mm
Design rules "default *": minimum track width 10mil, minimum drill 24mil, track to track 8mil, track to pad 8mil, pad to pad 8mil, via to via 8mil, smd to smd 8mil, copper to edge 40mil, drill to drill 8mil, minimum pad ring 10mil, minimum via ring 8mil, stop-mask expansion 4mil, vias tented up to drill 0mil, thermal gap 10mil
tRestrict: area 14.3,9.2 to 27,25.1

### Footprints (pad centres in the part's own frame; a part is rotated, then mirrored left to right if it is on the bottom)
CR1220-SMD = smd 3.2 x 3.2: +$1 -8.2,0; +$2 8.2,0 | smd 3.9 x 3.9: - 0,0
C0805 = smd 1.3 x 1.5: 1 -0.95,0; 2 0.95,0
0805 = smd 0.8 x 1.2: 1 -0.9,0; 2 0.9,0
1210 = smd 1.2 x 2: 1 -1.6,0; 2 1.6,0
CAPCP6032X280N = smd 2.261 x 2.413: 1 -2.134,0; 2 2.134,0
SMA-DIODE = smd 1.27 x 1.47: A -2.15,0; C 2.15,0
SOD-323 = smd 0.63 x 0.83: A 1.15,0; C -1.15,0
R1206 = smd 1.6 x 1.803: 1 -1.422,0; 2 1.422,0
CHIPLED_0805 = smd 1.2 x 1.2: A 0,-1.05; C 0,1.05
UNO_R3_SHIELD = drill 1.016 pad 1.88: 3.3V 50.8,26.67; 5V 50.8,29.21; A0 50.8,41.91; A1 50.8,44.45; A2 50.8,46.99; A3 50.8,49.53; A4 50.8,52.07; A5 50.8,54.61; AREF 2.54,15.24; D2 2.54,49.53; D3 2.54,46.99; D4 2.54,44.45; D5 2.54,41.91; D6 2.54,39.37; D7 2.54,36.83; D8 2.54,33.02; D9 2.54,30.48; D10 2.54,27.94; D11 2.54,25.4; D12 2.54,22.86; D13 2.54,20.32; GND@0 50.8,31.75; GND@1 50.8,34.29; GND@2 2.54,17.78; IOREF 50.8,21.59; NC 50.8,19.05; RES 50.8,24.13; RX 2.54,54.61; SCL 2.54,10.16; SDA 2.54,12.7; TX 2.54,52.07; VIN 50.8,36.83
1X08_PIN1_NO_SILK = drill 1.016 pad 1.88 square: 1 0,0 | drill 1.016 pad 1.88: 2 2.54,0; 3 5.08,0; 4 7.62,0; 5 10.16,0; 6 12.7,0; 7 15.24,0; 8 17.78,0
1X02 = drill 1.016 pad 1.88: 1 0,0; 2 2.54,0
0805' = smd 1.2 x 1: 1 -1.1,0; 2 1.1,0
SLF7045 = smd 1.5 x 2.2: 1 -3.2,0; 2 3.2,0
L2012C = smd 1 x 1: 1 -1,0; 2 1,0
SOT23-3 = smd 0.8 x 0.9: 1 -0.95,-1; 2 0.95,-1; 3 0,1.1
R0805 = smd 1.3 x 1.5: 1 -0.95,0; 2 0.95,0
SOIC127P600X175-14N = smd 1.981 x 0.533: 1 -2.464,3.81; 2 -2.464,2.54; 3 -2.464,1.27; 4 -2.464,0; 5 -2.464,-1.27; 6 -2.464,-2.54; 7 -2.464,-3.81; 8 2.464,-3.81; 9 2.464,-2.54; 10 2.464,-1.27; 11 2.464,0; 12 2.464,1.27; 13 2.464,2.54; 14 2.464,3.81
SOT95P280X100-5N = smd 1.219 x 0.508: 1 -1.219,0.94; 2 -1.219,0; 3 -1.219,-0.94; 4 1.219,-0.94; 5 1.219,0.94
SOP65P490X110-9N = smd 1.245 x 0.432: 1 -2.261,0.965; 2 -2.261,0.33; 3 -2.261,-0.33; 4 -2.261,-0.965; 5 2.261,-0.965; 6 2.261,-0.33; 7 2.261,0.33; 8 2.261,0.965 | smd 1.829 x 2.057: 9 0,0
FGPMMOPA6H = smd 2 x 1: P$1 -7.5,6.75; P$2 -7.5,5.25; P$3 -7.5,3.75; P$4 -7.5,2.25; P$5 -7.5,0.75; P$6 -7.5,-0.75; P$7 -7.5,-2.25; P$8 -7.5,-3.75; P$9 -7.5,-5.25; P$10 -7.5,-6.75; P$11 7.5,-6.75; P$12 7.5,-5.25; P$13 7.5,-3.75; P$14 7.5,-2.25; P$15 7.5,-0.75; P$16 7.5,0.75; P$17 7.5,2.25; P$18 7.5,3.75; P$19 7.5,5.25; P$20 7.5,6.75 | hole 3: 0.5,0.85
SOT95P280X100-6N = smd 1.219 x 0.508: 1 -1.143,0.94; 2 -1.143,0; 3 -1.143,-0.94; 4 1.143,-0.94; 5 1.143,0; 6 1.143,0.94
FIDUCIAL_1MM = smd 1 x 1: 1 0,0
3,2 = hole 3.2: 0,0
SMA-SMD = smd 1.73 x 1.73: 1 0,0 | smd 2.35 x 1.9: 2@1 -2.375,2.6; 2@2 -2.375,-2.6; 2@3 2.375,-2.6; 2@4 2.375,2.6 | smd 1.5 x 3.4: 2@5 -2.8,0; 2@6 2.8,0

### Placement (x,y rotation side)
BH2  35.26,44.15 180 bottom
C1  44.15,28.91 90 top
C2  43.51,14.3 180 top
C3  23.19,0.33 180 top
C4  41.61,18.11 270 top
C5  13.03,37.16 0 top
C6  33.35,19.38 90 top
C7  33.35,13.67 180 top
C8  33.35,16.84 180 top
C9  11.13,29.54 270 top
C10  33.35,10.49 180 top
C11  21.29,37.16 180 top
C15  6.05,21.92 270 top
C20  33.99,30.18 90 top
C21  35.26,41.61 180 top
C22  28.91,32.72 90 top
C23  34.62,36.53 180 top
D2  44.15,35.26 270 top
D3  39.07,33.35 270 top
F1  44.15,41.61 270 top
GPSLOCK  6.05,17.48 180 top
J1  -0.94,-3.48 0 top
JP1  21.92,53.67 0 top
JP2  7.95,51.13 0 top
JP3  27,0.33 0 top
L1  47nH  [0805']  37.16,12.4 270 top
L2  15.57,44.15 0 top
L3  9.22,25.1 270 top
L5  4.7uH  [0805']  35.26,39.07 180 top
Q1  25.73,4.14 180 top
Q2  29.54,4.14 180 top
Q3  33.35,4.14 180 top
R1  21.92,49.86 270 top
R2  49.86,8.59 270 top
R3  24.46,49.86 270 top
R4  27,49.86 270 top
R5  6.68,46.05 90 top
R6  18.75,0.33 180 top
R7  8.59,30.81 90 top
R9  23.83,30.81 90 top
R10  6.05,12.4 270 top
R11  33.35,7.95 0 top
R12  21.29,32.72 90 top
R16  39.07,30.18 90 top
R17  31.45,30.18 90 top
U1  43.51,8.59 180 top
U2  37.8,18.11 180 top
U3  16.21,32.08 0 top
U5  20.65,17.48 0 top
U8  35.26,33.99 0 top
U$1  5.41,-0.94 0 top
U$2  [3,2]  1.6,3.51 0 top
U$3  [3,2]  16.84,53.67 0 top
U$4  [3,2]  44.78,53.67 0 top
U$5  [3,2]  49.86,1.6 0 top
U$6  44.15,47.32 0 top
U$7  5.41,49.86 0 top
X2  11.13,2.87 0 top

### Tracks (layer width: path | path; a pad name or v marks a point on that pad's centre or on a via)
3.3V  (via drill 0.6)
  Top 0.406: J1.3.3V v33.35,23.19 | v7.32,26.37 9.22,26.37 L3.1
  Route15 0.406: v33.35,23.19 33.35,26.37 v7.32,26.37
5V  (via drill 0.6)
  Top 0.254: J1.5V 48.43,27.16 48.43,27.95 C1.1 | C2.1 44.78,14.3
  Top 0.406: U1.14 v39.07,4.78 | R2.2 v49.86,6.05 | R6.2 v16.21,0.33
  Top 1.422: C21.1 37.16,41.61 | 44.78,14.3 v46.69,14.3
  Route15 0.254: 37.48,38.27 20.81,38.27 JP2.1 | 37.8,38.27 37.8,39.07
  Route15 0.305: 37.48,38.27 37.8,38.27
  Route15 1.422: 44.78,26.37 47.32,26.37 47.32,39.07 37.8,39.07 37.8,48.59 32.08,48.59 JP1.5
  other vias: 37.8,37.16
  pour Top (no thermals): 36.53,35.26 36.53,38.43 35.89,38.43 35.89,42.88 38.43,42.88 38.43,35.26 37.16,35.26 37.16,34.62 36.53,34.62
  pour Route15: 15.57,2.24 38.43,2.24 38.43,5.41 43.51,5.41 43.51,25.73 42.24,25.73 42.24,29.54 51.77,29.54 51.77,4.78 45.42,4.78 40.97,1.6 40.97,-1.57 15.57,-1.57
  pour Route15: 39.07,39.7 39.07,35.89 37.16,35.89 37.16,39.7
7V_BUS  (via drill 0.6)
  Top 0.254: U2.1 39.07,17.16 39.07,17.22 | 39.07,19.38 39.07,19.22 U2.3
  Top 0.406: U2.3 41.61,19.05 C4.1 | 39.07,19.38 v39.07,20.02 | 39.07,17.22 40.34,17.22 v40.34,16.84
  Route15 0.406: v21.92,33.99 25.73,33.99 25.73,27.64 39.07,27.64 v39.07,20.02 40.34,20.02 v40.34,16.84
  pour Top (no thermals): 21.29,33.35 21.29,40.34 16.84,40.34 16.84,46.05 24.46,46.05 24.46,33.35
12V_VIN_FROM_RADIO  (via drill 0.61)
  Top 0.254: v45.89,35.89 45.89,41.13 44.15,42.88 F1.1 | v47.8,11.13 47.16,10.49 44.78,10.49 44.3,10.01 44.3,4.93 JP3.6
  Bottom 0.254: v45.89,35.89 45.89,32.4 47.64,30.65 47.64,13.35 47,12.71 47,11.13 v47.8,11.13
ALC_VOLTAGE
  Top 0.254: JP3.5 38.11,1.28 38.11,12.87 38.27,13.03 38.27,16.52 37.64,17.16 37.64,19.38 34.78,22.24 32.4,22.24 32.4,28.27
  pour Top (no thermals): 39.7,29.54 29.54,29.54 29.54,32.08 27.64,32.08 27.64,28.27 39.7,28.27
ALC_~SHDN  (via drill 0.61)
  Top 0.254: 35.73,33.19 36.37,33.19 U8.4 37,32.44 v37,32.08
  Bottom 0.254: J1.D13 9.38,24.62 34.78,24.62 37.16,27 37.16,31.92 v37,32.08
CW  (via drill 0.61)
  Top 0.254: U1.9 39.7,11.13 v39.7,13.35
  Bottom 0.254: v39.7,13.35 39.7,15.89 40.65,15.89 43.03,18.27 43.03,23.03 40.97,25.1 40.97,34.46 40.49,34.46 32.24,34.46 28.59,35.57 9.38,35.57 6.52,38.43 J1.D5
FUSED_12V_VIN  (via drill 0.6)
  Top 0.406: U3.2 9.86,32.41 9.86,33.35 | 10.49,33.35 11.43,33.35 C5.1 | U3.5 19.71,31.12 arc-90 v20.02,30.81
  Top 0.61: J1.VIN 44.15,33.35 D2.C 43.9,33.35 v42.24,33.35
  Route15 0.61: v20.02,30.81 10.49,30.81 v10.49,34.62 | v42.24,33.35 27,33.35 27,36.53 v10.87,36.53 10.8,36.53
  pour Top (no thermals): 11.76,37.8 11.76,32.72 9.86,32.72 9.86,37.8
GND  (via drill 0.6)
  Top 0.254: 34.14,33.99 U8.2 33.99,33.99 | 8.74,5.57 X2.2@1 | C3.2 22.4,0.33 23.03,0.97 23.03,3.35 24.62,4.93 Q1.2 | v8.59,0.33 8.74,0.33 X2.2@2 | v13.67,0.33 13.51,0.33 X2.2@3 | X2.2@4 13.51,5.41 v13.67,5.41 13.67,3.03 13.82,2.87 X2.2@6 | v8.59,5.41 8.59,3.03 8.43,2.87 X2.2@5
  Top 0.406: U3.8 18.75,33.33 18.75,33.99 | C4.2 41.61,18.11 U2.2 | v33.1,6.17 Q3.2 | X2.2@1 v8.59,5.41
  Top 0.61: 33.99,33.99 30.81,33.99 | R5.1 v6.68,42.88 | 44.47,30.18 C1.2 43.19,30.81 v42.24,30.81 | C4.2 41.61,16.21 v42.24,16.21 42.24,14.3 C2.2 | U1.7 v47.96,12.4 | C8.2 31.45,16.84 v31.45,15.57 31.45,13.67 | 31.45,13.67 C7.2 | 31.45,13.67 31.45,12.23 U5.P$12 | Q3.2 R11.2 | Q2.2 28.91,5.14 v28.91,6.68 | Q1.2 25.1,5.14 v25.1,6.68 | R10.2 10.49,11.45 v10.49,13.03 10.49,13.67 13.15,13.67 U5.P$8 | C15.2 6.05,20.65 v9.22,20.65 | U5.P$19 28.32,22.56 v30.81,22.56
  other vias: 28.27,34.62 30.81,36.53 21.29,28.91 16.21,28.91 13.03,28.91 17.48,34.62 15.57,37.8 35.26,44.15
  pour Route2: 0.33,-0.94 0.33,53.04 12.4,53.04 14.94,55.58 46.69,55.58 49.23,53.04 51.77,52.4 51.77,-0.3 49.86,-2.21 2.24,-2.21 0.97,-0.94
  pour Top (no thermals): 15.57,32.72 15.57,33.99 14.3,33.99 14.3,38.43 20.02,38.43 20.02,33.35 19.38,33.35 16.84,33.35 16.84,32.72
  pour Top (no thermals): 7.95,29.54 7.95,28.27 24.46,28.27 24.46,29.54 16.84,29.54 16.84,31.45 15.57,31.45 15.57,29.54 12.4,29.54 12.4,28.91 11.76,28.91 9.22,28.91 9.22,29.54
  pour Top (no thermals): 31.45,32.72 31.45,40.34 34.62,40.34 34.62,43.51 29.54,43.51 29.54,35.26 27.64,35.26 27.64,32.72
GPS_1PPS  (via drill 0.61)
  Top 0.254: v28.59,28.59 31.76,25.41 31.76,22.24 30.49,20.97 30.49,13.82 28.27,13.82 U5.P$13
  Bottom 0.254: v28.59,28.59 24.62,32.56 2.39,32.56 J1.D7
GPS_BATT  (via drill 0.6, 0.61)  (1 unrouted)
  Top 0.254: v11.28,19.86 13.03,19.86 U5.P$4 | v30.02,23.67 29.54,24.14 29.54,25.89 27.16,28.27 27.16,44.04 BH2.+$1 v27,44.15
  Bottom 0.254: v11.28,19.86 15.09,23.67 v30.02,23.67
GPS_RF
  Top 0.254: 32.4,10.49 R11.1 | 32.4,10.49 32.4,10.65 28.27,10.65 U5.P$11 | 32.4,10.49 C10.2
GPS_RX  (via drill 0.61)
  Top 0.254: v10.01,10.33 10.01,9.7 12.08,9.7 13.03,10.65 U5.P$10
  Route15 0.254: v10.01,10.33 10.01,12.24 2.71,19.54 2.71,21.92 J1.D11
GPS_TX  (via drill 0.61)
  Top 0.254: v11.28,10.65 11.28,12.08 13.03,12.08 U5.P$9 | v3.98,15.09 4.14,15.25 4.14,25.89 3.03,27 3.03,28.11 J1.D8
  Bottom 0.254: v11.28,10.65 6.84,15.09 v3.98,15.09
HARD_RX  (via drill 0.61)
  Top 0.254: v47.8,8.59 U1.4
  Bottom 0.254: v47.8,8.59 45.1,11.28 45.1,35.41 44.78,35.73 44.78,36.53 46.05,37.8 46.05,48.59 45.42,49.23 42.24,49.23 39.7,51.77 30.18,51.77 27.79,49.38 3.35,49.38 J1.RX
HARD_TX  (via drill 0.61)
  Top 0.254: 48.91,9.54 46.05,9.54 46.05,9.86 U1.5 | 48.91,9.54 R2.1 | 48.91,9.54 48.91,13.82 v43.99,18.75
  Bottom 0.254: v43.99,18.75 43.99,35.73 32.87,35.73 29.22,39.38 27,39.38 24.14,42.24 24.14,48.59 J1.TX
ISET
  Top 0.406: U3.3 8.59,31.75 R7.2
N$1  (via drill 0.61)
  Top 0.254: R6.1 21.13,-1.1 23.98,-1.1 23.98,0.33 C3.1 JP3.1 27,1.76 25.73,3.03 Q1.3 | v43.99,2.87 45.89,4.78 U1.1
  Bottom 0.254: v43.99,2.87 42.88,1.76 28.43,1.76 JP3.1
N$2
  Top 0.254: JP3.2 Q2.3
N$3
  Top 0.254: JP3.3 32.08,1.76 33.35,3.03 Q3.3
N$4  (via drill 0.61)
  Top 0.254: v30.65,9.7 27.95,7 27.95,6.52 26.68,5.25 Q1.1 | U1.6 v44.15,11.13
  Bottom 0.254: v30.65,9.7 32.08,11.13 v44.15,11.13
N$5
  Top 0.254: JP1.1 R1.1
N$6  (via drill 0.6)
  Top 0.254: 35.89,10.49 37.16,10.49 L1.2 | 35.89,10.49 C10.1 | v35.89,9.86 35.89,10.49
  Route15 0.254: X2.1 11.92,3.66 11.92,6.52 13.03,7.63 35.57,7.63 35.89,7.63 v35.89,9.86
  other vias: 11.13,2.87
N$7
  Top 0.254: JP1.2 R3.1
N$8
  Top 0.254: U1.2 46.05,6.05 46.05,7.32 U1.3
N$9  (via drill 0.61)
  Top 0.254: v30.49,6.36 30.49,5.25 Q2.1 | U1.12 v42.88,7.32
  Bottom 0.254: v30.49,6.36 31.45,7.32 v42.88,7.32
N$10  (via drill 0.61)
  Top 0.254: v34.62,6.36 34.62,5.57 34.3,5.25 Q3.1 | v39.07,6.36 39.7,7 39.7,9.06 40.49,9.86 U1.10
  Bottom 0.254: v39.07,6.36 v34.62,6.36
N$11
  Top 0.254: U5.P$1 13.03,24.14 9.22,24.14 L3.2 9.22,22.87 C15.1
N$12  (via drill 0.61)
  Top 0.254: v36.84,24.14 40.97,28.27 40.97,51.77 39.7,53.04 JP1.8
  Route15 0.254: J1.SCL 3.82,8.9 21.6,8.9 v36.84,24.14
N$13
  Top 0.254: U1.13 43.83,6.05 43.83,10.17 41.61,12.4 U1.8
N$14  (via drill 0.61)
  Top 0.254: v35.57,24.14 40.49,29.06 40.49,50.34 JP1.7
  Route15 0.254: J1.SDA 1.76,9.38 20.81,9.38 v35.57,24.14
N$15
  Top 0.254: JP1.3 R4.1
N$16  (via drill 0.61)
  Top 0.254: v6.2,37.48 9.38,40.65 9.38,48.91 R1.2
  Bottom 0.254: v6.2,37.48 4.62,35.89 J1.D6
N$17  (via drill 0.61)
  Top 0.254: v23.19,47.64 R3.2
  Bottom 0.254: v23.19,47.64 16.52,40.97 J1.D4
N$18  (via drill 0.61)
  Top 0.254: v24.78,27.79 25.1,28.11 25.1,47 R4.2
  Bottom 0.254: v24.78,27.79 24.3,27.32 1.92,27.32 J1.D9
N$19  (via drill 0.61)
  Top 0.254: R5.2 10.49,50.81 JP2.2 | R5.2 5.25,45.57 5.25,31.76 6.05,30.97 6.05,25.22 6.01,25.25 v5.41,25.25 | R5.2
  Bottom 0.254: J1.D10 2.39,25.25 v5.41,25.25
N$20  (via drill 0.61)
  Top 0.254: v37,2.71 JP3.4
  Bottom 0.254: v37,2.71 38.11,3.82 44.3,3.82 48.91,8.43 48.91,14.62 48.43,15.09 48.43,20.65 J1.RES
N$21
  Top 0.406: U2.4 35.89,19.05 35.89,20.02 33.35,20.02 C6.2
N$22
  Top 0.254: GPSLOCK.A 6.05,18.43 13.03,18.43 13.03,18.27 U5.P$5
N$23
  Top 0.254: R10.1 GPSLOCK.C
N$25
  Top 0.254: F1.2 D2.A
N$27
  Top 0.406: D3.A R16.2
N$28
  pour Top (no thermals): 34.62,34.62 32.72,34.62 32.72,39.7 35.26,39.7 35.26,37.8 34.62,37.8
N$33
  Top 0.406: C23.1 35.26,36.26 35.26,33.99 U8.5 | U8.5 36.46,34.05 | D3.C arc-90 38.55,33.99 U8.5
N$37
  pour Top (no thermals): 30.18,30.18 35.26,30.18 35.26,33.22 32.72,33.22 32.72,32.08 30.18,32.08
PTT  (via drill 0.61)
  Top 0.254: v42.88,8.59 U1.11 | v3.19,16.05 3.03,16.21 3.03,17.95 J1.D12
  Bottom 0.254: v42.88,8.59 42.72,8.74 16.05,8.74 8.74,16.05 v3.19,16.05
SS
  Top 0.406: U3.4 11.13,31.12 C9.1
SW
  Top 0.406: U3.1 13.03,33.68 | 13.03,43.51 12.37,43.51 L2.1
  Top 1.016: 13.03,33.68 13.03,43.51
  pour Top (no thermals): 14.94,40.34 14.94,46.05 11.13,46.05 10.49,46.05 10.49,39.07 14.94,39.07
VCC
  Top 0.406: C6.1 34.25,18.48 C8.1 35.89,16.84 35.89,17.17 U2.5 36.53,17.17 36.53,13.67 | 36.53,13.67 37.16,13.67 L1.1 | C7.1 36.53,13.67
  pour Top (no thermals): 37.8,13.03 33.35,13.03 33.35,18.75 35.26,18.75 35.26,17.48 37.16,17.48 37.16,14.3 37.8,14.3
VFB
  Top 0.406: U3.6 21.29,31.75 R12.1 23.83,31.82 R9.2

### Text on the board
tPlace: copyright 2016 Iron Heart Consulting | ALC | 12V | KEY | PTT | RST | RMT | 100-0004-500 Rev E
tNames: GPS Ant